# EAGLE design micD21.v51a1 (EAGLE 7.3.0)

## Sheet 1 of 2
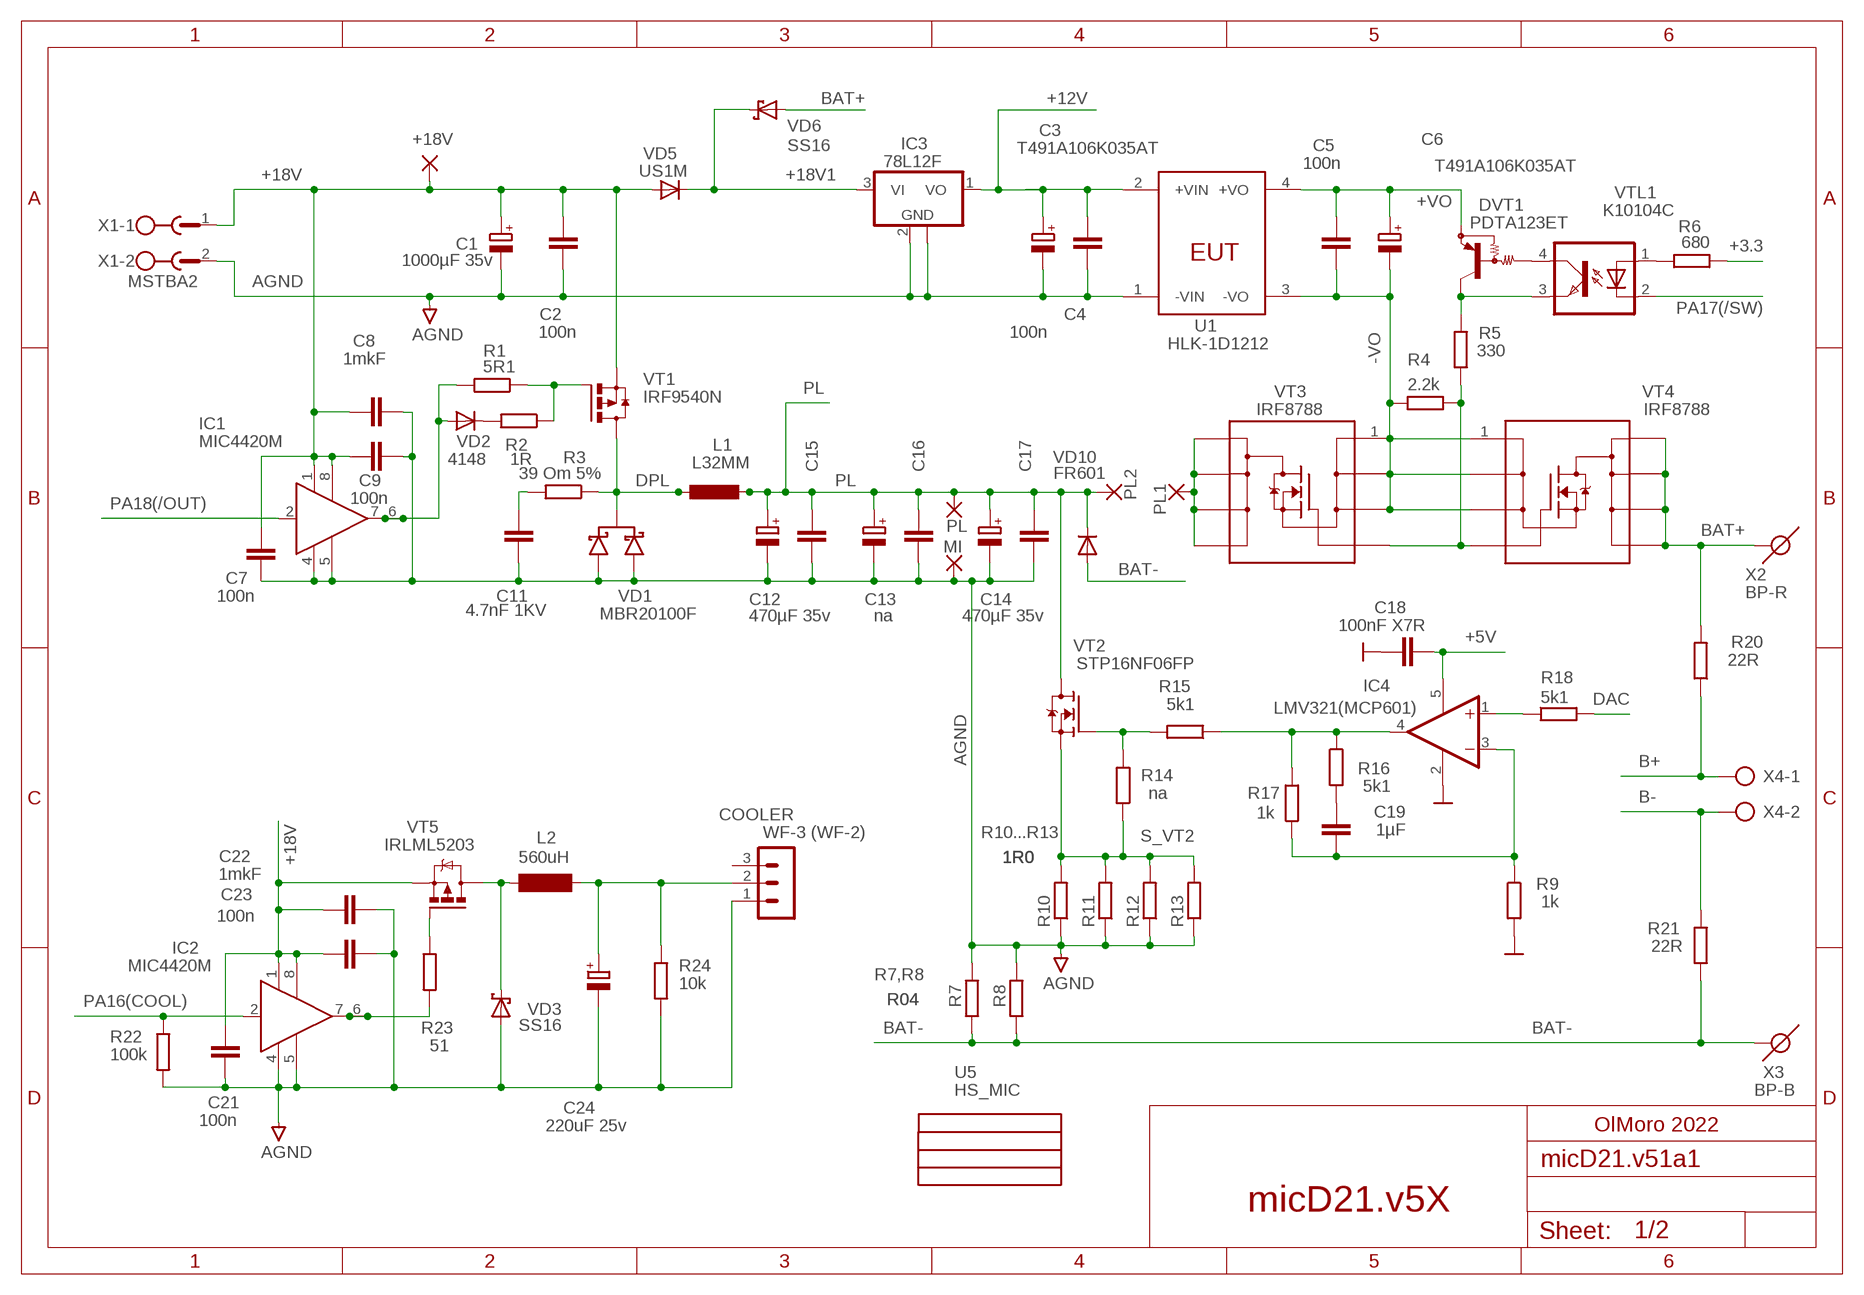
[diagram p0: schematic, sheet 1]

### Parts
+18V  WIREPAD1,6/0,8  [1,6/0,8]
C1  1000µF 35v  CPOL-EUE5-10.5  [E5-10,5]
C2  100n  C-EUC0805  [C0805]
C3  T491A106K035AT  CPOL-EUCT3528  [CT3528]
C4  100n  C-EUC0603  [C0603]
C5  100n  C-EUC0603  [C0603]
C6  T491A106K035AT  CPOL-EUCT3528  [CT3528]
C7  100n  C-EUC0603  [C0603]
C8  1mkF  C-EUC0603  [C0603]
C9  100n  C-EUC0603  [C0603]
C11  4.7nF 1KV  C-EU102-064X133  [C102-064X133]
C12  470µF 35v  CPOL-EUE5-10.5  [E5-10,5]
C13  na  CPOL-EUE5-13  [E5-13]
C14  470µF 35v  CPOL-EUE5-10.5  [E5-10,5]
C15  1mkF  C-EUC0805  [C0805]
C16  1mkF  C-EUC0805  [C0805]
C17  1mkF  C-EUC0805  [C0805]
C18  100nF X7R  C-EUC0603  [C0603]
C19  1µF  C-EUC0603  [C0603]
C21  100n  C-EUC0603  [C0603]
C22  1mkF  C-EUC0603  [C0603]
C23  100n  C-EUC0603  [C0603]
C24  220uF 25v  CPOL-EUE5-8.5  [E5-8,5]
COOLER  WF-3 (WF-2)  WF-3  [WF-3]
DVT1  PDTA123ET  MUN2113T1  [SC59-BEC]
IC1  MIC4420M  [SO-08]
IC2  MIC4420M  [SO-08]
IC3  78L12F  [SOT89]
IC4  LMV321(MCP601)  LM321MF  [SOT23-5]
L1  L32MM  [L22MM]
L2  560uH  BS11  [BS11]
MI  WIREPAD4,16O1,6  [4,16O1,6]
PL  WIREPAD4,16O1,6  [4,16O1,6]
PL1  WIREPAD2,54/0,8  [2,54/0,8]
PL2  WIREPAD2,54/0,8  [2,54/0,8]
R1  5R1  R-EU_R0805  [R0805]
R2  1R  R-EU_R0805  [R0805]
R3  39 Om 5%  R-0515/20  [0515/20]
R4  2.2k  R-EU_R0603  [R0603]
R5  330  R-EU_R0603  [R0603]
R6  680  R-EU_R0603  [R0603]
R7  R04  R-EU_R2512  [R2512]
R8  R04  R-EU_R2512  [R2512]
R9  1k  R-EU_R0603  [R0603]
R10  1R0  R-EU_R2512  [R2512]
R11  1R0  R-EU_R2512  [R2512]
R12  1R0  R-EU_R2512  [R2512]
R13  1R0  R-EU_R2512  [R2512]
R14  na  R-EU_R0603  [R0603]
R15  5k1  R-EU_R0603  [R0603]
R16  5k1  R-EU_R0603  [R0603]
R17  1k  R-EU_R0603  [R0603]
R18  5k1  R-EU_R0603  [R0603]
R20  22R  R-EU_R0603  [R0603]
R21  22R  R-EU_R0603  [R0603]
R22  100k  R-EU_R0603  [R0603]
R23  51  R-EU_R0603  [R0603]
R24  10k  R-EU_R0603  [R0603]
U1  HLK-1D1212  [HLK-1D1212]
U5  HS_MIC  [HS-MIC]
VD1  MBR20100F  [ITO220J]
VD2  4148  DIODESMA  [SMADIODE]
VD3  SS16  [DO214AC]
VD5  US1M  [DO214AC]
VD6  SS16  [DO214AC]
VD10  FR601  DIODE-1_DIODE-P6-15  [DIODE-1_P6-15]
VT1  IRF9540N  [TO-220FP]
VT2  STP16NF06FP  [TO-220FP]
VT3  IRF8788  [SO-8]
VT4  IRF8788  [SO-8]
VT5  IRLML5203  [MICRO3]
VTL1  K10104C  SFH618A-3X007  [SMD4-7]
X1  MSTBA2  [MSTBA2]
X2  BP-R  [BP-R]
X3  BP-B  [BP-B]
X4  AK500/2-H  [AK500/2-H]

### Nets
+3.3: R6.1 ; also sheet 2
+5V: C18.2 IC4.5(V+) ; also sheet 2
+12V: C3.+ C4.2 IC3.1(VO) U1.2(+VIN) ; also sheet 2
+18V: +18V.1(P) C1.+ C2.2 C7.2 C8.2 C9.2 C21.2 C22.2 C23.2 IC1.1(VS) IC1.8(VS1) IC2.1(VS) IC2.8(VS1) VD5.A VT1.3(S) VT5.2(S) X1.1 ; also sheet 2
+18V1: IC3.3(VI) VD5.C VD6.C ; also sheet 2
+VO: C5.2 C6.+ DVT1.E U1.4(+VO)
-VO: C5.1 C6.- R4.2 U1.3(-VO) VT3.1(S) VT3.2(S) VT3.3(S) VT4.1(S) VT4.2(S) VT4.3(S)
AGND: C1.- C2.1 C3.- C4.1 C7.1 C8.1 C9.1 C11.2 C12.- C13.- C14.- C15.2 C16.2 C17.2 C21.1 C22.1 C23.1 C24.- COOLER.1 IC1.4(GND) IC1.5(GND1) IC2.4(GND) IC2.5(GND1) IC3.2(GND) IC3.2@1(GND) MI.1(P) R7.2 R8.2 R10.1 R11.1 R12.1 R13.1 R22.2 R24.2 U1.1(-VIN) VD1.1(A1) VD1.3(A2) VD3.A X1.2 ; also sheet 2
B+: R20.1 X4.1 ; also sheet 2
B-: R21.1 X4.2 ; also sheet 2
BAT+: R20.2 VD6.A VT4.5(D) VT4.6(D) VT4.7(D) VT4.8(D) X2.1
BAT-: R7.1 R8.1 R21.2 VD10.A X3.1 ; also sheet 2
DAC: R18.2 ; also sheet 2
DPL: L1.2@7 L1.2@8 R3.1 VD1.2(C) VT1.2(D)
G: R4.1 R5.1 VT3.4(G) VT4.4(G)
GND: C18.1 IC4.2(V-) R9.2 ; supply symbol labelled  ; also sheet 2
N$1: R6.2 VTL1.1(A)
N$2: R2.2 VD2.C
N$3: IC1.6(OUT) IC1.7(OUT) R1.2 VD2.A
N$4: R1.1 R2.1 VT1.1(G)
N$7: C11.1 R3.2
N$9: IC2.6(OUT) IC2.7(OUT) R23.2
N$10: R23.1 VT5.1(G)
N$11: L2.1 VD3.C VT5.3(D)
N$12: C24.+ COOLER.2 L2.2 R24.1
N$35: R14.2 R15.2 VT2.1(G)
N$41: IC4.1(+IN) R18.1
N$43: C19.1 R16.2
N$53: DVT1.C R5.2 VTL1.3(EMIT)
N$54: DVT1.B VTL1.4(COL)
N$55: C19.2 IC4.3(-IN) R9.1 R17.1
PA16(COOL): IC2.2(IN) R22.1 ; also sheet 2
PA17(/SW): VTL1.2(C) ; also sheet 2
PA18(/OUT): IC1.2(IN) ; also sheet 2
PL: C12.+ C13.+ C14.+ C15.1 C16.1 C17.1 L1.1 L1.1@2 PL2.1(P) PL.1(P) VD10.C VT2.2(D)
PL1: PL1.1(P) VT3.5(D) VT3.6(D) VT3.7(D) VT3.8(D)
S_VT2: R10.2 R11.2 R12.2 R13.2 R14.1 VT2.3(S)
UDAC: IC4.4(OUT) R15.1 R16.1 R17.2
Unconnected: COOLER.3

### Notes on the sheet
- R10...R13
- R7,R8
- OlMoro 2022
- micD21.v5X

## Sheet 2 of 2
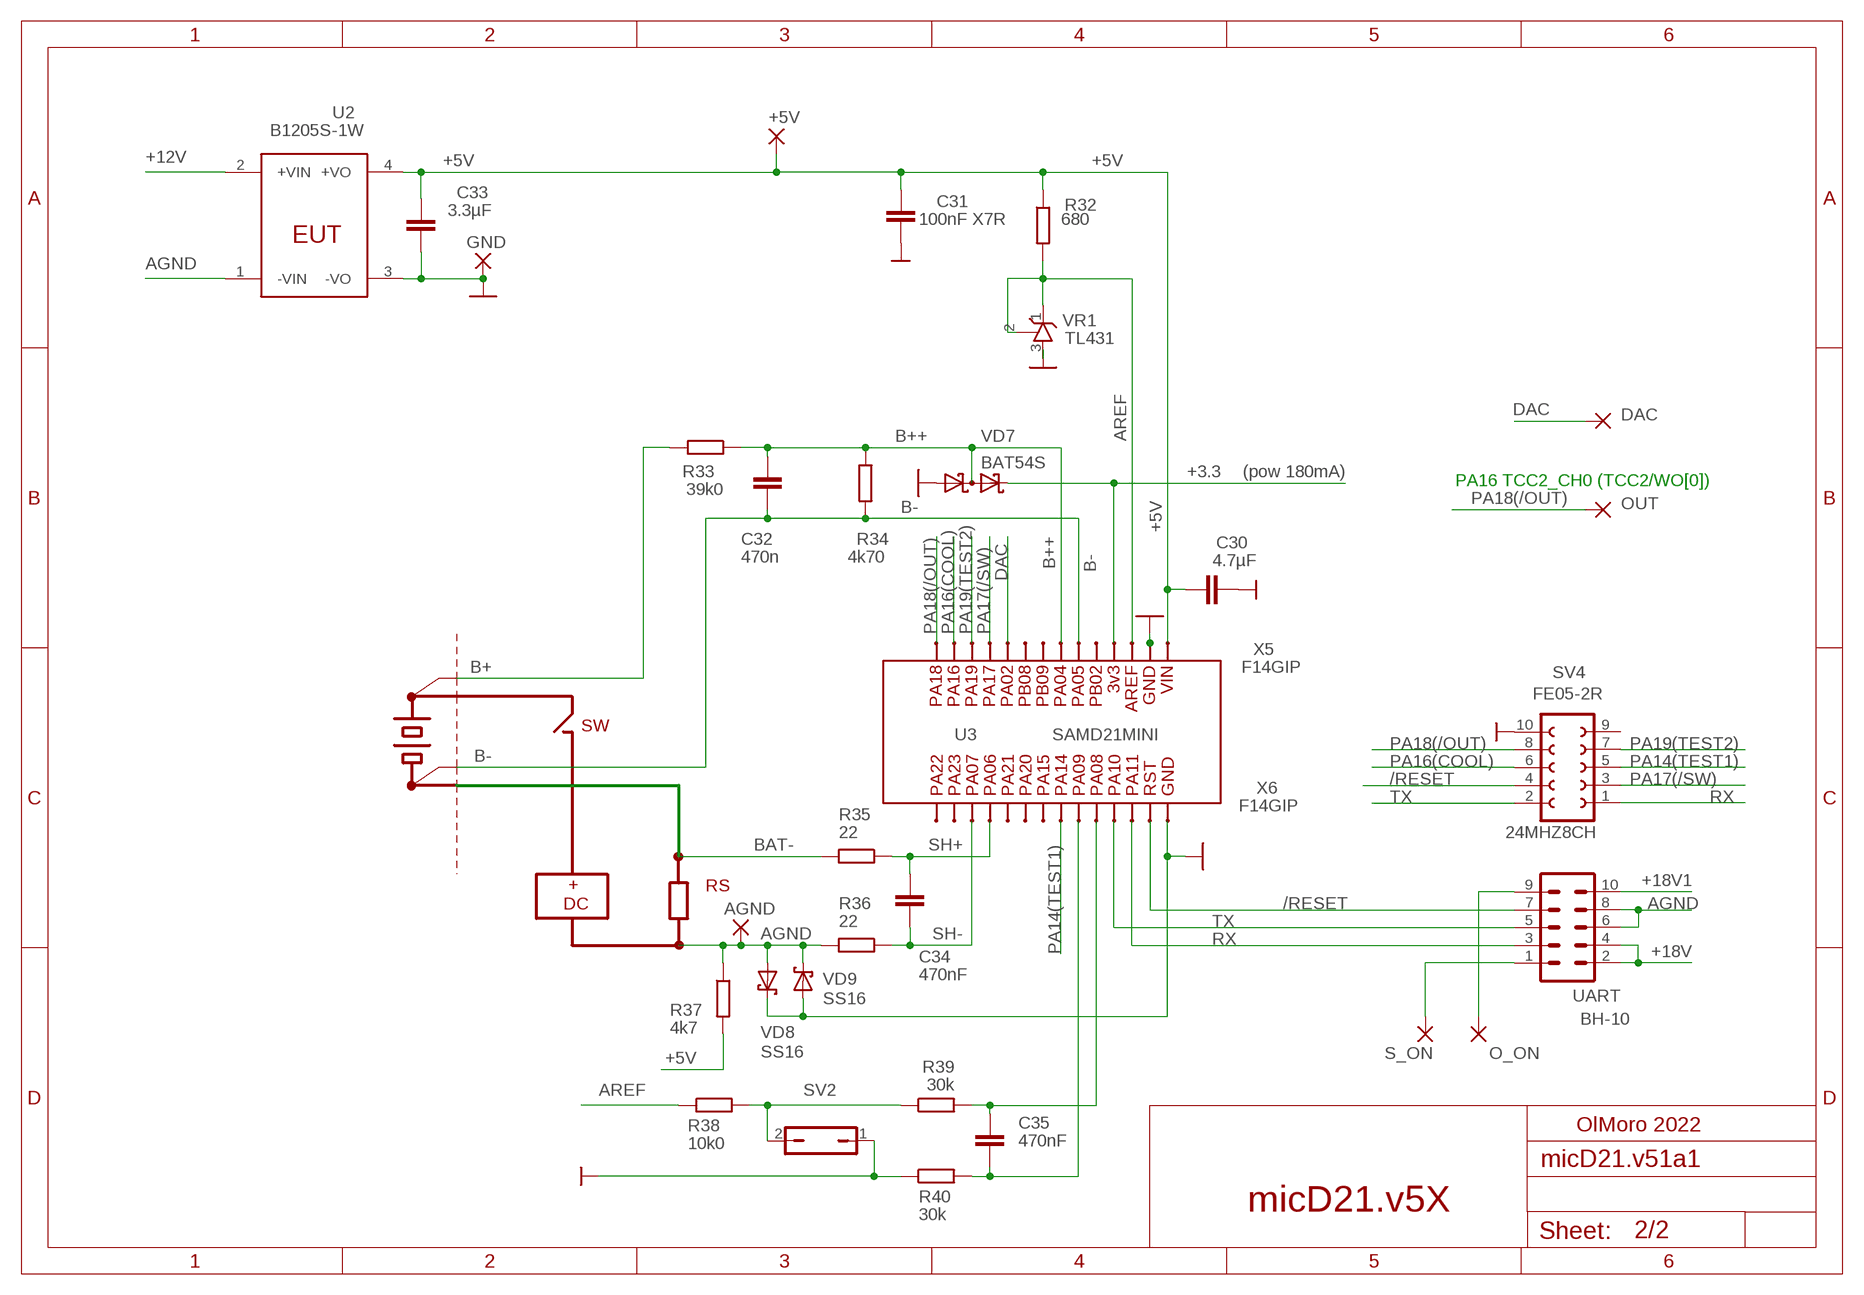
[diagram p1: schematic, sheet 2]

### Parts
24MHZ8CH  DIAGNOSTICS  [DIAGNOSTICS]
+5V  WIREPAD1,6/0,8  [1,6/0,8]
AGND  AGND  WIREPAD4,16O1,6  [4,16O1,6]
C30  4.7µF  C-EUC0805  [C0805]
C31  100nF X7R  C-EUC0603  [C0603]
C32  470n  C-EUC0603  [C0603]
C33  3.3µF  C-EUC0805  [C0805]
C34  470nF  C-EUC0603  [C0603]
C35  470nF  C-EUC0805  [C0805]
DAC  WIREPAD1,6/0,8  [1,6/0,8]
GND  GND  WIREPAD4,16O1,6  [4,16O1,6]
O_ON  WIREPAD1,6/0,8  [1,6/0,8]
OUT  WIREPAD1,6/0,8  [1,6/0,8]
R32  680  R-EU_R0603  [R0603]
R33  39k0  R-EU_R0603  [R0603]
R34  4k70  R-EU_R0603  [R0603]
R35  22  R-EU_R0603  [R0603]
R36  22  R-EU_R0603  [R0603]
R37  4k7  R-EU_R0603  [R0603]
R38  10k0  R-EU_R0603  [R0603]
R39  30k  R-EU_R0603  [R0603]
R40  30k  R-EU_R0603  [R0603]
S_ON  WIREPAD1,6/0,8  [1,6/0,8]
SV2  JP1Q  [JP1]
SV4  FE05-2R  [FE05-2R]
U2  B1205S-1W  HLK-1D1212  [HLK-1D1212]
U3  SAMD21MINI  [SAMD21MINI]
UART  BH-10  ML10  [ML10]
VD7  BAT54S  [SOT23]
VD8  SS16  [DO214AC]
VD9  SS16  [DO214AC]
VR1  TL431  TL431-SOT23-3  [SOT23]
X5  F14GIP  [F14GIP]
X6  F14GIP  [F14GIP]

### Nets
+3.3: VD7.2(C2) X5.4 ; also sheet 1
+5V: +5V.1(P) C30.1 C31.1 C33.1 R32.1 R37.2 U2.4(+VO) X5.1 ; also sheet 1
+12V: U2.2(+VIN) ; also sheet 1
+18V: UART.2 UART.4 ; also sheet 1
+18V1: UART.10 ; also sheet 1
/OUT_ON: O_ON.1(P) UART.9
/RESET: SV4.4 UART.7 X6.13
/S_ON: S_ON.1(P) UART.1
AGND: AGND.1(P) R36.2 R37.1 U2.1(-VIN) UART.6 UART.8 VD8.A VD9.C ; also sheet 1
AREF: R32.2 R38.1 VR1.1(C) VR1.2(R) X5.3
B+: R33.2 ; also sheet 1
B++: C32.1 R33.1 R34.1 VD7.3(C1A2) X5.7
B-: C32.2 R34.2 X5.6 ; also sheet 1
BAT-: R35.2 ; also sheet 1
CELSIUS: C35.1 R39.2 X6.10
DAC: DAC.1(P) X5.10 ; also sheet 1
GND: C30.2 C31.2 C33.2 GND.1(P) R40.1 SV2.1 SV4.10 U2.3(-VO) VD7.1(A1) VD8.C VD9.A VR1.3(A) X5.2 X6.14 ; supply symbol labelled  ; also sheet 1
N$5: C35.2 R40.2 X6.9
N$13: R38.2 R39.1 SV2.2
PA14(TEST1): SV4.5 X6.8
PA16(COOL): SV4.6 X5.13 ; also sheet 1
PA17(/SW): SV4.3 X5.11 ; also sheet 1
PA18(/OUT): OUT.1(P) SV4.8 X5.14 ; also sheet 1
PA19(TEST2): SV4.7 X5.12
RX: SV4.1 UART.3 X6.12
SH+: C34.1 R35.1 X6.4
SH-: C34.2 R36.1 X6.3
TX: SV4.2 UART.5 X6.11
Unconnected: SV4.9 X5.5 X5.8 X5.9 X6.1 X6.2 X6.5 X6.6 X6.7

### Notes on the sheet
- (pow 180mA)
- PA16 TCC2_CH0 (TCC2/WO[0])
- SW
- RS
- +
  DC
- OlMoro 2022
- micD21.v5X

## Library data of the parts
24MHZ8CH = Q921:DIAGNOSTICS
+5V +18V AGND DAC GND MI O_ON OUT PL PL1 PL2 S_ON = wirepad:WIREPAD: Wire PAD connect wire on PCB
C1 C3 C6 C12-C14 C24 = rcl_moro:CPOL-EU: POLARIZED CAPACITOR, European symbol
C2 C4 C5 C7-C9 C11 C15-C19 C21-C23 C30-C35 = rcl_moro:C-EU: CAPACITOR, European symbol
COOLER = moro2:WF-3
DVT1 = transistor-pnp:MUN2113*: PNP Bias Resistor Transistor
IC1 IC2 = transistor-power:MIC4420: 6A-Peak Low-Side MOSFET Driver Bipolar/CMOS/DMOS Process http://www.micrel.com/_PDF/mic4420.pdf
IC3 = linear:78L*: POSITOIV-VOLTAGE REGULATORS Output up to 100 mA Source: Datasheet <http://focus.ti.com/lit/ds/symlink/ua78l05.pdf>
IC4 = linear:LM321?*: Low Power Single Op Amp Source: http://cache.national.com/ds/LM/LM321.pdf
L1 = wx-d21:L32MM
L2 = inductor-neosid-moro:BS: INDUCTOR nominal inductance, magnetically screened; OC_FARNELL: unknown; OC_NEWARK: unknown
R1 R2 R4-R18 R20-R24 R32-R40 = rcl_moro:R-EU_: RESISTOR, European symbol
R3 = Q921:R-0515/20
SV2 = jumper_moro:JP1Q: JUMPER
SV4 = con-lsta_moro:FE05-2R
U1 U2 = wx-d21:HLK-1D1212
U3 = Q921:SAMD21MINI
U5 = wx-d21:HS_MIC
UART = con-harting-ml:ML10: HARTING; OC_FARNELL: unknown; OC_NEWARK: unknown
VD1 = wx-d21:MBR20100F
VD2 = microbuilder:DIODE: Diode SMADIODE - SMA Surface Mount Package 20V 1A Schottky Diode Digikey (500mV @ 1A, 500uA Vr @ 20V): 641-1014-6-ND SOD-123 30V 500mA (430mV Vf, 130uA Vr @ 30V) Schottky Diode - Digikey: B0530W-FDICT-ND SOD-323 10V 570mA (380mV Vf, 3ns) Schottky Diode - Digikey: ZLLS410CT-ND SOD-523 30V 30mA Schottky Diode (RB751S-40TE61) - Digikey: RB751S-40TE61CT-ND SOT23-R/W - SOT23 Package (R = Solder Paste/Reflow Ovens, W = Hand-Soldering) BAT54Film 40V 300mA - Digikey: 497-7162-1-ND DO-1N4148 Through Hole Small Current Diode (any model)
VD3 VD6 VD8 VD9 = diode-1:SS16
VD5 = diode-1:US1M
VD7 = diode:BAT54S: Schottky Diodes Pin connection corrected 2011-05-04 Source: Fairchild .. BAT54.pdf
VD10 = urc-2base:DIODE-1_DIODE-: DIODE
VR1 = moro4:TL431-SOT23-3
VT1 = wx-d21:IRF9540N
VT2 = wx-d21:STP16NF06FP
VT3 VT4 = transistor-fet_moro:IRF8788
VT5 = transistor-power:IRLML5203: HEXFET P-Channel Power MOSFET
VTL1 = optocoupler:SFH618?*: Optocoupler, Phototransistor Output, Low Input Current Source: Data sheet <http://www.vishay.com/docs/83673/sfh618.pdf>; OC_FARNELL: unknown; OC_NEWARK: unknown
X1 = con-phoenix-508:MSTBA2: PHOENIX; MF: FARNELL; MPN: 1757242; OC_FARNELL: 3705171; OC_NEWARK: 71C4161
X2 = wx-d21:BP-R
X3 = wx-d21:BP-B
X4 = con-ptr500_moro:AK500/2-H: CONNECTOR Aug. 2004 / PTR Meßtechnik: Die Bezeichnung der Serie AK505 wurde geändert. Es handelt sich hierbei um AK500 in horizontaler Ausführung.; OC_FARNELL: unknown; OC_NEWARK: unknown
X5 X6 = wx-d21:F14GIP

## Board
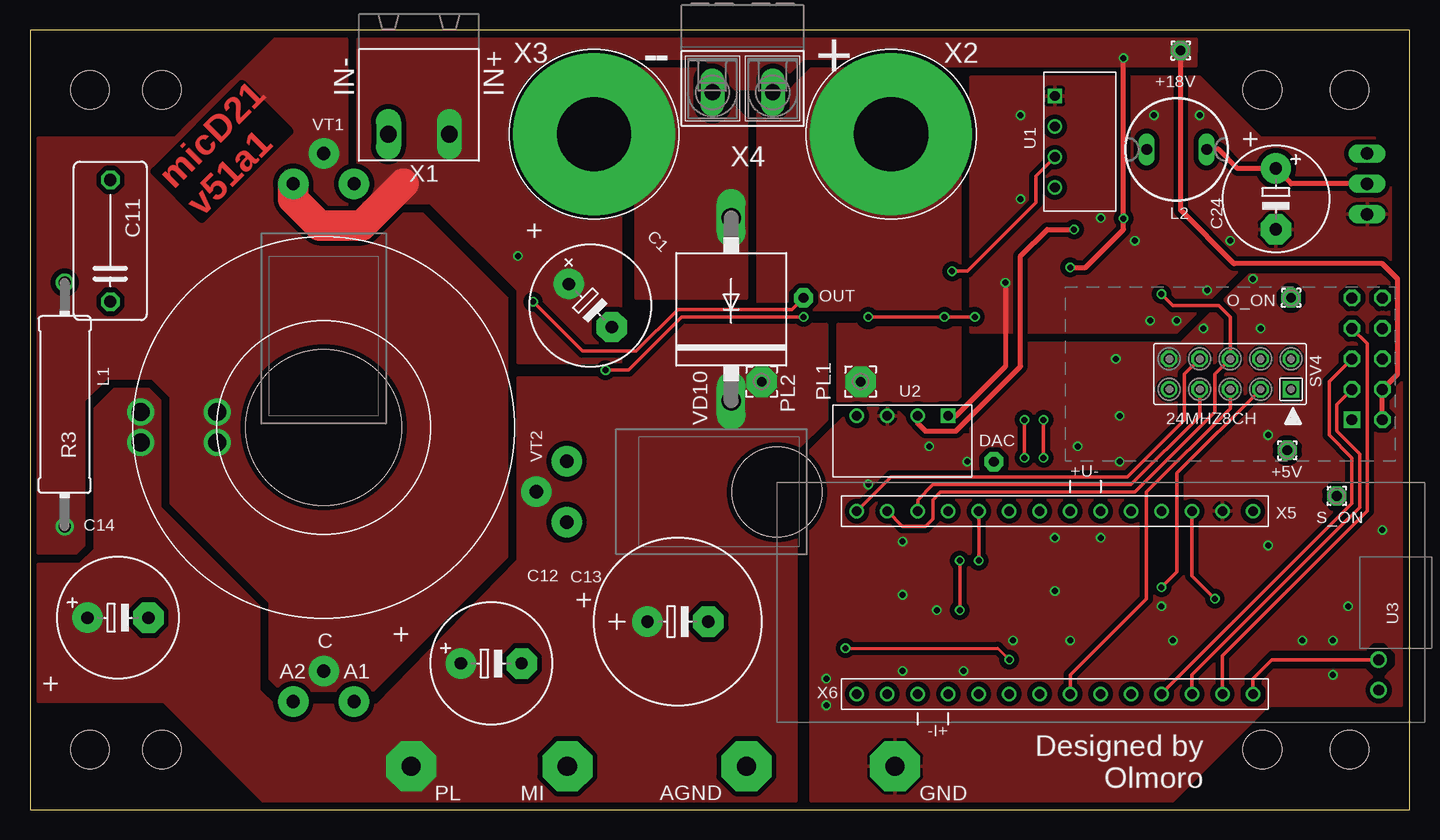
[diagram p2: board, top side]
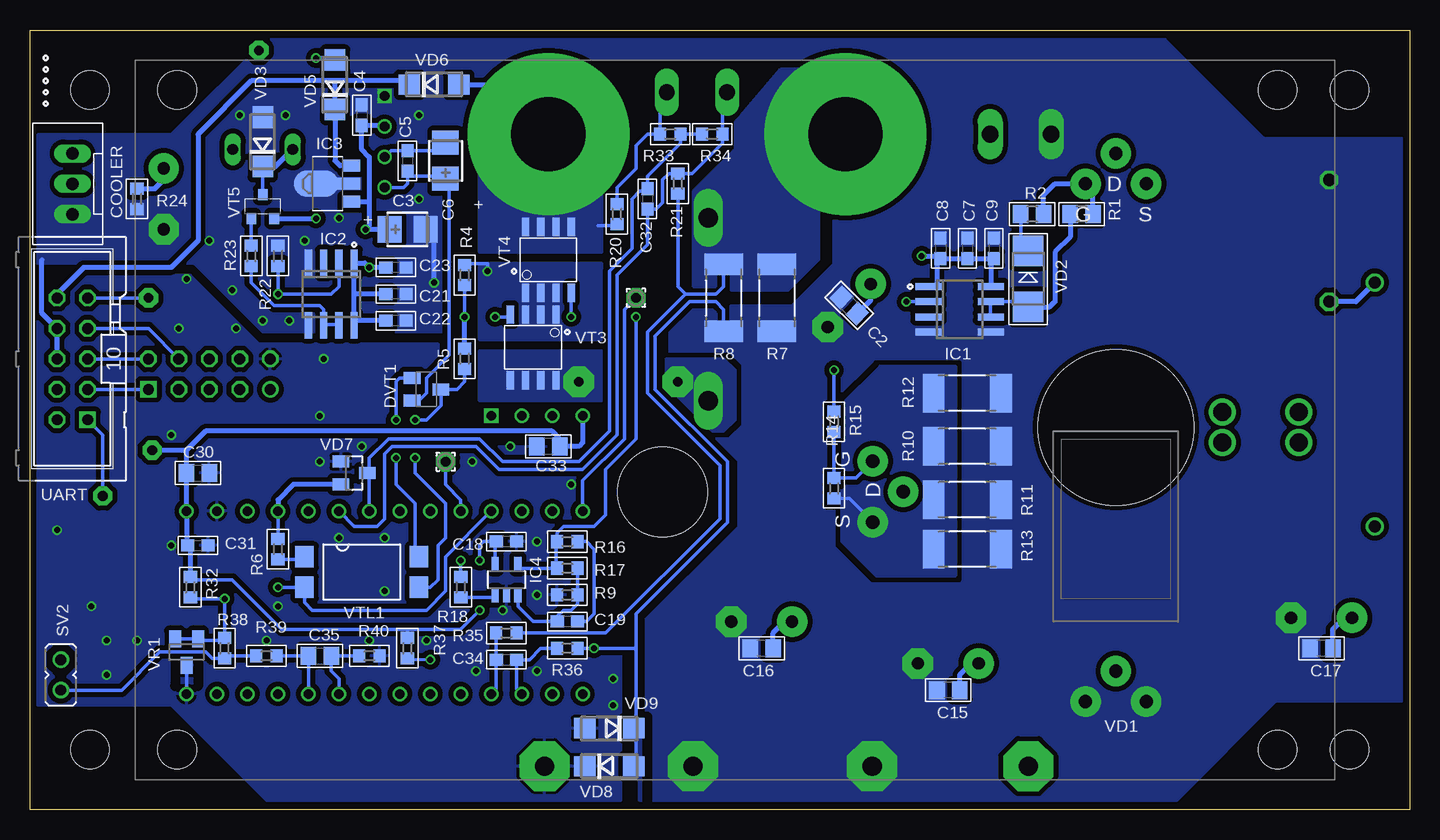
[diagram p3: board, bottom side, seen from below]

Size 115 x 65 mm. Coordinates in mm from the lower left corner, seen from the top.
Outline: 0,0 115,0 115,65 0,65 0,0
Copper layers (1*16): Top 0.018mm / dielectric 1.5mm / Bottom 0.018mm
Design rules "020204mm *": minimum track width 0.2mm, minimum drill 0.3mm, track to track 0.2mm, track to pad 0.2mm, pad to pad 0.2mm, via to via 0.2mm, smd to smd 0.2mm, copper to edge 0.4mm, drill to drill 0.4mm, minimum pad ring 0.15mm, minimum via ring 0.15mm, stop-mask expansion 4mil, vias tented up to drill 20mil, thermal gap 10mil
Holes 3.2 mm at 5,5 5,60 110,60 110,5 11,60 102.73,60 102.73,5 11,5
Holes 7.5 mm at 62.26,26.47
Holes 13 mm at 24.48,31.86
tRestrict: 20 lines
bRestrict: 15 lines
vRestrict: area 2,2 to 8,8; area 8,2 to 14,8; area 2,57 to 8,63; area 8,57 to 14,63; area 99.8,57 to 105.8,63; area 107,57 to 113,63; area 107,2 to 113,8; area 99.8,2 to 105.8,8

### Footprints (pad centres in the part's own frame; a part is rotated, then mirrored left to right if it is on the bottom)
1,6/0,8 = drill 0.813 pad 1.6 octagon: 1 0,0
4,16O1,6 = drill 1.6 pad 4.166 octagon: 1 0,0
E5-10,5 = drill 1.016 pad 2.54: + -2.54,0 | drill 1.016 pad 2.54 octagon: - 2.54,0
C0805 = smd 1.3 x 1.5: 1 -0.95,0; 2 0.95,0
CT3528 = smd 2 x 2.2: + 1.5,0; - -1.5,0
C0603 = smd 1.1 x 1: 1 -0.85,0; 2 0.85,0
C102-064X133 = drill 1.016 octagon: 1 -5.08,0; 2 5.08,0
E5-13 = drill 1.016 pad 2.54: + -2.54,0 | drill 1.016 pad 2.54 octagon: - 2.54,0
E5-8,5 = drill 1.016 pad 2.54: + -2.54,0 | drill 1.016 pad 2.54 octagon: - 2.54,0
WF-3 = drill 1.016 long: 1 0,-2.54; 2 0,0; 3 0,2.54
SC59-BEC = smd 1 x 1.4: B -0.95,-1.2; C 0,1.2; E 0.95,-1.2
SO-08 = smd 0.6 x 2.2: 1 -1.905,-2.6; 2 -0.635,-2.6; 3 0.635,-2.6; 4 1.905,-2.6; 5 1.905,2.6; 6 0.635,2.6; 7 -0.635,2.6; 8 -1.905,2.6
SOT89 = smd 1 x 1.5: 1 -1.499,-1.981; 3 1.499,-1.981 | smd 1 x 2: 2 0,-1.727 | smd 2.2 x 3.7: 2@1 0,0.94
SOT23-5 = smd 0.6 x 1.2: 1 -0.95,-1.306; 2 0,-1.306; 3 0.95,-1.306; 4 0.95,1.306; 5 -0.95,1.306
L22MM = drill 1.5: 1 -1.27,15.24; 1@2 1.27,15.24; 2@7 -1.27,8.89; 2@8 1.27,8.89
BS11 = drill 0.9 long: 1 -2.5,0; 2 2.5,0
2,54/0,8 = drill 0.813 pad 2.54 octagon: 1 0,0
R0805 = smd 1.3 x 1.5: 1 -0.95,0; 2 0.95,0
0515/20 = drill 1.016: 1 -10.16,0; 2 10.16,0
R0603 = smd 1 x 1.1: 1 -0.85,0; 2 0.85,0
R2512 = smd 1.8 x 3.2: 1 -2.8,0; 2 2.8,0
JP1 = drill 0.914: 1 0,-1.27; 2 0,1.27
FE05-2R = drill 0.914 square: 1 5.08,-1.27 | drill 0.914 octagon: 2 5.08,1.27; 3 2.54,-1.27; 4 2.54,1.27; 5 0,-1.27; 6 0,1.27; 7 -2.54,-1.27; 8 -2.54,1.27; 10 -5.08,1.27 | drill 0.914: 9 -5.08,-1.27
HLK-1D1212 = drill 0.8 square: 1 -3.81,0 | drill 0.8: 2 -1.27,0; 3 1.27,0; 4 3.81,0
ML10 = drill 0.914 square: 1 -5.08,-1.27 | drill 0.914 octagon: 2 -5.08,1.27; 3 -2.54,-1.27; 4 -2.54,1.27; 5 0,-1.27; 6 0,1.27; 7 2.54,-1.27; 8 2.54,1.27; 9 5.08,-1.27; 10 5.08,1.27
ITO220J = drill 1.118 pad 2.54: 1 2.54,-2.54; 2 0,0; 3 -2.54,-2.54
SMADIODE = smd 2.54 x 2.54: A 2.349,0; C -2.349,0
DO214AC = smd 1.8 x 1.7: A 2.05,0; C -2.05,0
SOT23 = smd 1 x 1.4: 1 -0.95,-1.1; 2 0.95,-1.1; 3 0,1.1
DIODE-1_P6-15 = drill 1.6 long: A 7.62,0; C -7.62,0
TO-220FP = drill 1.118 pad 2.54: 1 2.54,0; 2 0,-2.54; 3 -2.54,0
SO-8 = smd 1.524 x 0.61: 1 -2.743,1.905; 2 -2.743,0.635; 3 -2.743,-0.635; 4 -2.743,-1.905; 5 2.743,-1.905; 6 2.743,-0.635; 7 2.743,0.635; 8 2.743,1.905
MICRO3 = smd 0.8 x 0.9: 1 -0.95,-1; 2 0.95,-1; 3 0,1
SMD4-7 = smd 1.78 x 1.55: 1 -1.27,-4.77; 2 1.27,-4.77; 3 1.27,4.77; 4 -1.27,4.77
MSTBA2 = drill 1.397 long: 1 -2.54,5.08; 2 2.54,5.08
BP-R = drill 6.2 pad 13.5: 1 0,0
BP-B = drill 6.2 pad 13.5: 1 0,0
AK500/2-H = drill 1.321 long: 1 -2.515,0; 2 2.515,0
F14GIP = drill 0.8: 1 -16.51,0; 2 -13.97,0; 3 -11.43,0; 4 -8.89,0; 5 -6.35,0; 6 -3.81,0; 7 -1.27,0; 8 1.27,0; 9 3.81,0; 10 6.35,0; 11 8.89,0; 12 11.43,0; 13 13.97,0; 14 16.51,0

### Placement (x,y rotation side)
24MHZ8CH  100.05,36.31 0 top
+5V  104.81,29.96 180 top
+18V  95.92,63.3 90 top
AGND  59.72,3.61 0 top
C1  46.7,42.02 315 top
C2  46.7,42.02 315 bottom
C3  83.53,48.38 180 bottom
C4  87.34,57.9 270 bottom
C5  83.53,54.09 270 bottom
C6  80.36,54.09 270 bottom
C7  36.86,46.79 270 bottom
C8  39.09,46.79 270 bottom
C9  34.64,46.79 270 bottom
C11  6.7,47.42 90 top
C12  38.45,12.18 0 top
C13  54.01,15.67 0 top
C14  7.34,15.99 0 top
C15  38.45,9.96 180 bottom
C16  54.01,13.45 180 bottom
C17  7.34,13.45 180 bottom
C18  75.28,22.34 180 bottom
C19  70.2,15.67 180 bottom
C21  84.49,42.98 180 bottom
C22  84.49,40.76 180 bottom
C23  84.49,45.2 180 bottom
C24  103.85,50.91 270 top
C30  101,28.05 0 bottom
C31  101,22.02 0 bottom
C32  63.53,50.91 270 bottom
C33  71.79,30.28 180 bottom
C34  75.28,12.5 0 bottom
C35  90.84,12.82 0 bottom
COOLER  111.46,52.17 0 bottom
DAC  80.36,29.01 90 bottom
DVT1  81.95,35.04 270 bottom
GND  72.11,3.61 0 top
IC1  37.5,41.71 270 bottom
IC2  89.88,42.98 180 bottom
IC3  90.2,52.19 90 bottom
IC4  75.28,19.16 0 bottom
L1  24.48,31.86 90 top
L2  95.6,55.04 0 top
MI  44.8,3.61 0 top
O_ON  105.12,42.66 0 top
OUT  64.48,42.66 270 bottom
PL  31.78,3.61 0 top
PL1  69.25,35.67 0 top
PL2  60.99,35.67 0 top
R1  27.34,49.64 180 bottom
R2  31.46,49.64 180 bottom
R3  2.89,33.77 90 top
R4  78.77,44.56 90 bottom
R5  78.77,37.58 270 bottom
R6  94.33,21.7 270 bottom
R7  52.74,42.66 270 bottom
R8  57.18,42.66 270 bottom
R9  70.2,17.89 180 bottom
R10  36.86,30.28 180 bottom
R11  36.86,25.83 180 bottom
R12  36.86,34.72 180 bottom
R13  36.86,21.7 180 bottom
R14  47.98,26.79 90 bottom
R15  47.98,32.34 270 bottom
R16  70.2,22.34 0 bottom
R17  70.2,20.12 180 bottom
R18  79.09,18.53 90 bottom
R20  66.07,49.64 270 bottom
R21  60.99,52.19 270 bottom
R22  94.33,46.15 90 bottom
R23  96.55,46.15 270 bottom
R24  106.08,50.91 270 bottom
R32  101.63,18.53 270 bottom
R33  61.63,56.31 180 bottom
R34  58.13,56.31 0 bottom
R35  75.28,14.72 0 bottom
R36  70.2,13.45 0 bottom
R37  83.53,13.45 90 bottom
R38  98.78,13.45 270 bottom
R39  95.28,12.82 0 bottom
R40  86.71,12.82 180 bottom
S_ON  108.94,26.15 0 top
SV2  112.43,11.23 180 bottom
SV4  100.05,36.31 0 top
U1  85.44,55.68 270 top
U2  72.74,32.82 180 top
U3  89.25,17.26 0 top
U5  56.23,32.5 0 top
UART  111.47,37.58 90 bottom
VD1  24.48,11.55 0 top
VD2  31.78,44.25 270 bottom
VD3  95.6,55.68 90 bottom
VD5  89.57,60.44 90 bottom
VD6  81.31,60.44 0 bottom
VD7  87.98,28.05 270 bottom
VD8  66.71,3.61 0 bottom
VD9  66.71,6.78 180 bottom
VD10  58.45,41.71 90 top
VR1  101.95,13.13 180 bottom
VT1  24.48,52.19 180 bottom
VT2  44.74,26.51 90 bottom
VT3  73.06,38.53 270 bottom
VT4  71.79,45.84 90 bottom
VT5  95.6,50.28 0 bottom
VTL1  87.34,19.8 270 bottom
X1  32.42,61.39 180 top
X2  71.79,56.31 0 top
X3  47.02,56.31 0 top
X4  59.41,59.8 180 top
X5  85.44,24.88 180 top
X6  85.44,9.64 0 top

### Tracks (layer width: path | path; a pad name or v marks a point on that pad's centre or on a via)
+3.3
  Bottom 0.305: R6.1 X5.4
  Bottom 0.406: VD7.2 93.06,27.11 94.33,25.83 X5.4
+5V  (via drill 0.5)
  Top 0.305: v77.5,16.62 v77.5,20.75
  Bottom 0.305: 101.63,19.16 98.14,19.16 94.01,15.04 83.53,15.04 | 83.53,15.04 R37.2 | 83.53,15.04 79.09,15.04 v77.5,16.62 | v77.5,20.75 77.5,22.02 77.19,22.34 C18.2 76.23,22.24 IC4.5
  Bottom 0.406: 101.63,19.16 R32.1 101.63,22.02 C31.1 101.95,22.12 X5.1 C30.1 101.95,29.96 | 101.95,29.96 100.36,31.55 71.47,31.55 70.84,30.91 C33.1 69.25,30.28 68.93,30.59 U2.4 | +5V.1 101.95,29.96
+12V  (via drill 0.5)
  Top 0.406: U2.2 74.01,32.18 74.64,31.55 77.19,31.55 82.58,36.95 82.58,46.15 84.81,48.38 v87.03,48.38
  Bottom 0.406: U1.2 85.54,57.05 C4.2 87.34,55.04 86.71,54.41 86.71,50.6 | 86.71,50.6 86.71,48.69 v87.03,48.38 C3.+ 85.44,48.78 85.12,49.1 | IC3.1 86.8,50.69 86.71,50.6
+18V  (via drill 0.5)
  Top 0.406: UART.2 UART.4 114.02,36.31 114.02,44.25 112.75,45.52 100.36,45.52 95.92,49.96 +18V.1 | v91.16,62.66 v91.16,49.28 91.16,48.38 87.98,45.2 v86.71,45.2
  Top 2.54: VT1.3 21.94,50.91 24.16,48.69 27.66,48.69 31.15,52.19
  Bottom 0.406: 34.32,43.61 IC1.8 34.9,45.94 C9.2 C7.2 C8.2 | 87.98,42.98 IC2.8 87.98,40.76 C22.2 | 87.98,42.98 IC2.1 87.09,45.58 v86.71,45.2 C23.2 | C21.2 87.98,42.98 | VT5.2 v91.16,49.28 | v91.16,62.66 89.74,62.66 VD5.A | v40.67,46.15 39.09,46.15 C8.2 | C8.2 39.4,45.94 39.4,43.61 IC1.1 | C2.2 44.91,42.48 C1.+
  pour Top (isolate 0.406, no thermals): 27.34,64.25 27.34,50.6 33.37,50.6 40.67,43.3 40.67,37.26 49.24,37.26 49.24,62.03 49.88,62.66 56.23,62.66 58.77,60.12 61.95,60.12 64.48,62.66 74.64,62.66 75.28,62.03 97.19,62.03 97.23,64.25
+18V1
  Bottom 0.406: 89.57,60.76 83.68,60.76 VD6.C | 89.57,60.76 96.55,60.76 101,56.31 101,47.42 103.22,45.2 110.52,45.2 112.75,42.98 UART.10 | 89.57,60.76 VD5.C 89.57,54.09 89.16,53.68 IC3.3
+VO
  Bottom 0.305: U1.4 83.85,51.87 83.53,52.19 C5.2 83.53,53.14 83.22,52.82 80.59,52.82 C6.+ 80.68,52.27 80.13,52.27 80.04,52.19 80.04,37.9 81.95,35.99 81.95,34.72 82.58,34.09 DVT1.E
-VO  (via drill 0.5)
  Top 0.305: U1.3 83.85,52.82 83.85,50.6 78.14,44.88 v76.87,44.88
  Bottom 0.305: U1.3 84.91,54.94 C5.1 81.01,54.94 C6.- | v76.87,44.88 76.87,45.52 78.77,45.52 R4.2
  pour Bottom (isolate 0.406, no thermals): 67.34,45.52 77.5,45.52 77.5,39.17 67.34,39.17
/OUT_ON
  Bottom 0.305: O_ON.1 UART.9
/RESET
  Top 0.305: X6.13 99.41,12.82 111.47,24.88 111.47,38.85 UART.7
  Bottom 0.305: UART.7 105.12,40.12 SV4.4
/S_ON
  Bottom 0.305: S_ON.1 108.94,31.23 UART.1
AGND  (via drill 0.5)
  Top 0.254: v67.98,13.45 80.68,13.45 v81.63,12.5
  Top 0.406: v81.31,43.93 81.31,36.95 77.19,32.82 U2.1
  Bottom 0.254: v81.63,12.5 83.53,12.5 R37.1
  Bottom 0.305: R8.2 57.18,41.71 57.82,42.34 60.04,42.34 62.9,39.48 62.9,35.04 56.87,29.01 56.87,23.93 64.48,16.31 64.48,13.45 | R36.2 v67.98,13.45 64.48,13.45 | 64.48,13.45 64.48,6.95 VD9.C 64.48,6.78 64.48,3.78 VD8.A
  Bottom 0.406: v81.31,43.93 81.31,48.38 C3.- | UART.6 UART.8 114.02,41.39 114.02,45.84
  other vias: 82.58,57.9 82.58,50.91 89.25,49.33 92.11,47.42 93.38,40.76 95.6,40.76 98.14,43.3 100.05,47.42 97.5,57.9 93.69,57.9
  pour Top (isolate 0.406): 78.45,39.8 78.45,61.08 97.5,61.08 102.59,56 112.11,56 113.38,54.73 113.38,45.52 101.31,45.52 95.6,39.8
  pour Bottom (isolate 0.406, rank 2, no thermals): 61.63,39.8 59.72,41.71 58.13,41.71 57.82,41.39 57.82,40.12 56.55,40.12 56.55,42.02 51.47,42.02 47.98,45.52 47.98,60.76 49.88,62.66 74.64,62.66 78.45,58.85 78.45,39.8 95.6,39.8 101.31,45.52 114.33,45.52 114.33,56.31 103.22,56.31 95.28,64.25 20.39,64.25 12.14,56 0.67,56 0.67,9 11.15,9 19.4,0.75 64.17,0.75 64.17,15.36 55.91,23.61 55.91,29.01 61.63,34.72
AREF  (via drill 0.5)
  Top 0.305: X5.3 96.87,19.48 v98.78,17.58
  Bottom 0.305: VR1.2 VR1.1 100.85,14.09 98.78,14.09 R38.1 v98.78,17.58 101.53,17.58 R32.2
B+
  Bottom 0.305: R33.2 62.58,56.31 | R33.2 62.48,59.25 X4.1 | R33.2 63.53,56.31 64.48,55.36 64.48,53.45 66.07,51.87 R20.1
B++
  Bottom 0.305: 86.71,28.05 86.71,29.32 85.12,30.91 77.5,30.91 75.6,29.01 69.25,29.01 66.71,31.55 66.71,44.88 64.8,46.79 64.8,50.91 64.17,51.55 63.53,51.55 C32.1 63.53,52.82 60.78,55.58 R33.1 R34.1 | VD7.3 86.71,28.05 | 86.71,28.05 X5.7
B-
  Bottom 0.305: X5.6 87.98,23.61 86.08,23.61 85.44,24.24 85.44,29.64 84.81,30.28 77.82,30.28 75.91,28.37 68.93,28.37 66.07,31.23 66.07,44.56 63.53,47.11 C32.2 62.8,50.06 62.26,50.6 62.26,52.5 61.73,53.03 R21.1 59.83,53.03 57.28,55.58 R34.2 | R34.2 57.18,56.31 | R34.2 57.28,59.41 X4.2
BAT+
  Bottom 0.305: R20.2 66.17,48.69 67.66,48.69
  Bottom 0.406: VD6.A 75.91,60.44 75.28,59.8
  pour Top (isolate 0.406, no thermals): 60.67,41.71 77.5,41.71 77.5,58.22 74.01,61.71 65.12,61.71 62.26,58.85 60.67,58.85
  pour Bottom (isolate 0.406, no thermals): 67.34,46.47 77.5,46.47 77.5,58.22 74.01,61.71 69.88,61.71 67.34,59.17
BAT-
  Bottom 0.305: 60.36,42.98 63.53,39.8 63.53,34.72 57.5,28.69 57.5,24.24 67.03,14.72 R35.2 | 60.36,42.98 57.82,42.98 57.18,43.61 R8.1 | R21.2 60.99,43.61 60.36,42.98
  pour Top (isolate 0.61, no thermals): 55.59,61.71 50.52,61.71 50.52,42.66 59.72,42.66 59.72,57.58
  pour Bottom (isolate 0.406, no thermals): 49.24,45.84 49.24,60.44 50.52,61.71 52.42,61.71 56.23,57.27 56.23,55.04 59.72,51.55 59.72,43.61 57.82,43.61 57.82,45.2 56.55,45.2 56.55,43.3 51.78,43.3
CELSIUS
  Bottom 0.305: X6.10 C35.1 R39.2
DAC  (via drill 0.5)
  Top 0.305: v79.09,20.75 X5.10
  Bottom 0.305: X5.10 79.09,25.83 80.36,27.1 DAC.1 | R18.2 v79.09,20.75
DPL
  pour Top (isolate 0.406, no thermals): 13.37,57.27 13.41,57.27 20.39,64.25 26.39,64.25 26.39,49.64 32.73,49.64 39.72,42.66 39.72,21.07 28.61,9.96 20.99,9.96 20.03,10.91 20.03,17.26 11.78,25.52 11.78,34.41 10.19,35.99 6.38,35.99 4.48,34.09 4.48,22.02 3.84,21.39 0.67,21.39 0.67,56 12.1,56
G  (via drill 0.5)
  Top 0.305: v69.88,41.07 v76.23,41.07 v78.77,41.07
  Bottom 0.305: VT4.4 v69.88,41.07 | v78.77,41.07 R4.1 | v76.23,41.07 74.96,41.07 VT3.4
  Bottom 0.406: R5.1 v78.77,41.07
GND  (via drill 0.5)
  Top 0.305: X6.14 101.95,10.91 103.54,12.5 SV2.1
  Bottom 0.305: X6.14 VR1.3
  other vias: 109.89,16.94 102.59,40.12 90.84,29.01 94.33,16.94 86.71,14.09 95.28,14.09 106.08,14.09 108.62,14.09 85.44,18.21 101.95,44.25 77.82,11.55 72.74,17.89 66.39,10.91 75.6,16.62 72.74,22.34 90.84,32.82 87.34,30.28 78.14,29.01 90.52,37.58 85.44,22.66 66.39,8.69 108.62,11.23 103.22,31.23 72.74,11.55 81.95,14.09 103.22,22.02 112.75,23.29 74.96,30.28 69.88,27.1 89.25,22.66 97.82,40.12
  pour Bottom (isolate 0.406, rank 2): 114.33,8.69 114.33,44.56 101.63,44.56 95.92,38.85 81,38.85 81,30.28 65.75,30.28 65.75,0.75 95.28,0.75 103.22,8.69
  pour Top (isolate 0.406, rank 2): 114.33,8.69 114.33,44.56 101.63,44.56 95.92,38.85 78.45,38.85 78.45,31.23 74.33,31.23 72.11,33.45 68.61,33.45 65.12,29.96 65.12,0.75 95.28,0.75 103.22,8.69
N$1
  Bottom 0.305: VTL1.1 92.33,20.86 R6.2
N$2
  Bottom 0.305: R2.2 32.41,47.23 VD2.C
N$3
  Bottom 0.305: IC1.6 34.96,41.13 34.96,42.34 IC1.7 32.23,42.34 VD2.A
  Bottom 0.406: R1.2 28.29,47.74 29.56,46.47 29.56,42.34 30,41.9 VD2.A
N$4
  Bottom 0.406: R1.1 26.39,51.55 VT1.1 29.56,52.19 30.52,51.23 R2.1
N$5
  Bottom 0.305: R40.2 C35.2 89.88,11.55 89.25,10.91 X6.9
N$7
  Bottom 0.406: R3.2 4.48,42.34 C11.1
N$9
  Bottom 0.305: R23.2 96.55,43.93 94.65,42.02 90.84,42.02 90.52,41.71 IC2.6 90.46,40.44 89.25,40.44 IC2.7
N$10
  Bottom 0.305: R23.1 VT5.1
N$11
  Bottom 0.305: VT5.3 VD3.C
  Bottom 0.406: VD3.C 94.52,53.63 L2.1
N$12
  Top 0.406: L2.2 99.09,55.04 100.68,53.45 C24.+ 105.14,52.17 COOLER.2
  Bottom 0.406: R24.1 104.59,51.77 103.85,52.5 C24.+
N$13
  Bottom 0.305: R39.1 98.56,12.82 R38.2 99.83,12.6 100.36,13.13 104.17,13.13 107.35,9.96 SV2.2
N$35
  Bottom 0.305: R15.2 R14.2 46.15,27.63 VT2.1
N$41
  Bottom 0.305: IC4.1 76.41,17.68 R18.1
N$43
  Bottom 0.305: R16.2 68.61,22.34 67.98,21.7 67.98,16.31 68.61,15.67 C19.1
N$53  (via drill 0.5)
  Top 0.305: v82.9,32.5 v82.9,29.32
  Bottom 0.305: v82.9,29.32 82.9,28.05 80.36,25.52 80.36,22.66 81,22.02 81,19.16 81.63,18.53 VTL1.3 | R5.2 78.77,35.67 79.41,35.04 DVT1.C 80.75,33.7 81.95,32.5 v82.9,32.5
N$54  (via drill 0.5)
  Top 0.305: v84.49,29.32 v84.49,32.5
  Bottom 0.305: v84.49,29.32 84.49,27.1 82.9,25.52 82.9,21.39 VTL1.4 | DVT1.B 84.17,35.99 84.49,35.67 v84.49,32.5
N$55
  Bottom 0.305: IC4.3 74.33,16.95 73.06,15.67 C19.2 71.05,16.09 70.52,16.62 69.88,16.62 69.35,17.16 R9.1 R17.1
PA14(TEST1)
  Top 0.305: SV4.5 100.05,33.45 93.06,26.47 93.06,17.58 86.71,11.23 X6.8
PA16(COOL)  (via drill 0.5)
  Top 0.305: X5.13 72.74,23.61 74.64,23.61 75.28,24.24 75.28,25.83 75.91,26.47 92.11,26.47 98.78,33.13 98.78,36.31 SV4.6 100.05,41.07 99.09,42.02 95.28,42.02 v94.33,42.98
  Bottom 0.305: R22.1 v94.33,42.98 89.88,42.98 89.25,43.61 IC2.2
PA17(/SW)  (via drill 0.5)
  Top 0.305: SV4.3 95.6,28.05 95.6,19.8 v94.33,18.53
  Bottom 0.305: X5.11 80.36,21.07 80.36,18.21 81.95,16.62 91.47,16.62 92.12,17.27 VTL1.2 v94.33,18.53
PA18(/OUT)  (via drill 0.5)
  Top 0.305: SV4.8 96.23,36.31 96.23,32.5 91.47,27.74 71.79,27.74 X5.14 | OUT.1 63.53,41.71 54.01,41.71 50.52,38.22 46.07,38.22 v41.94,42.34
  Bottom 0.305: OUT.1 65.44,41.71 65.44,30.91 68.93,27.42 X5.14 | v41.94,42.34 IC1.2
PA19(TEST2)
  Top 0.305: X5.12 74.01,25.83 75.28,27.1 91.79,27.1 97.5,32.82 SV4.7
PL
  Bottom 0.406: C16.1 53.06,14.72 52.1,15.67 C13.+ | C15.1 37.5,11.23 36.55,12.18 C12.+ | C17.1 6.38,15.04 5.43,15.99 C14.+
  pour Top (isolate 0.406, no thermals): 0.67,9 0.67,20.44 4.16,20.44 5.43,21.7 5.43,33.45 7.02,35.04 9.88,35.04 10.83,34.09 10.83,25.2 19.08,16.94 19.08,9.96 20.35,8.69 28.93,8.69 40.67,20.75 40.67,35.99 49.56,35.99 54.01,40.44 66.39,40.44 66.39,32.5 63.85,29.96 63.85,0.75 19.4,0.75 11.15,9
  pour Bottom (isolate 0.61, no thermals): 58.45,31.55 62.26,35.36 62.26,37.26 61.95,37.58 57.18,37.58 56.23,36.63 56.23,32.5 57.18,31.55
PL1
  pour Top (isolate 0.61, no thermals): 67.66,40.44 77.5,40.44 77.5,34.09 67.34,34.09 67.34,40.44
  pour Bottom (isolate 0.406, no thermals): 67.34,38.22 77.5,38.22 77.5,34.09 67.34,34.09
RX
  Top 0.305: X6.12 96.87,11.23 108.94,23.29 110.84,25.2 110.84,29.64 108.94,31.55 108.94,33.77 UART.3
  Bottom 0.305: SV4.1 UART.3
S_VT2
  Bottom 0.305: VT2.3 46.71,25.93 R14.1
  pour Bottom (isolate 0.406, no thermals): 44.48,19.48 37.81,19.48 37.81,36.95 44.16,36.95 47.34,33.77 47.34,22.34
SH+
  Bottom 0.305: R35.1 C34.1 76.13,10.06 X6.4
SH-
  Bottom 0.305: X6.3 74.43,10.06 C34.2 73.38,12.5 72.42,13.45 R36.1
TX
  Top 0.305: X6.11 110.2,25.52 110.2,29.32 108.3,31.23 108.3,35.67 UART.5
  Bottom 0.305: SV4.2 UART.5
UDAC  (via drill 0.5)
  Top 0.305: v64.48,41.07 54.33,41.07 49.88,36.63 v47.98,36.63
  Bottom 0.305: R15.1 v47.98,36.63 | v64.48,41.07 64.48,30.91 67.03,28.37 67.03,24.56 67.98,23.61 70.52,23.61 71.05,23.08 R16.1 71.15,22.24 71.15,20.12 | IC4.4 74.33,20.12 71.15,20.12 | R17.2 71.15,20.12

### Text on the board
Top: micD21 / v51a1
tPlace: + | + | +U- | + | + | + | -I+ | Designed by / Olmoro
bPlace: + | +
tNames: IN+ | + | - | - | IN-